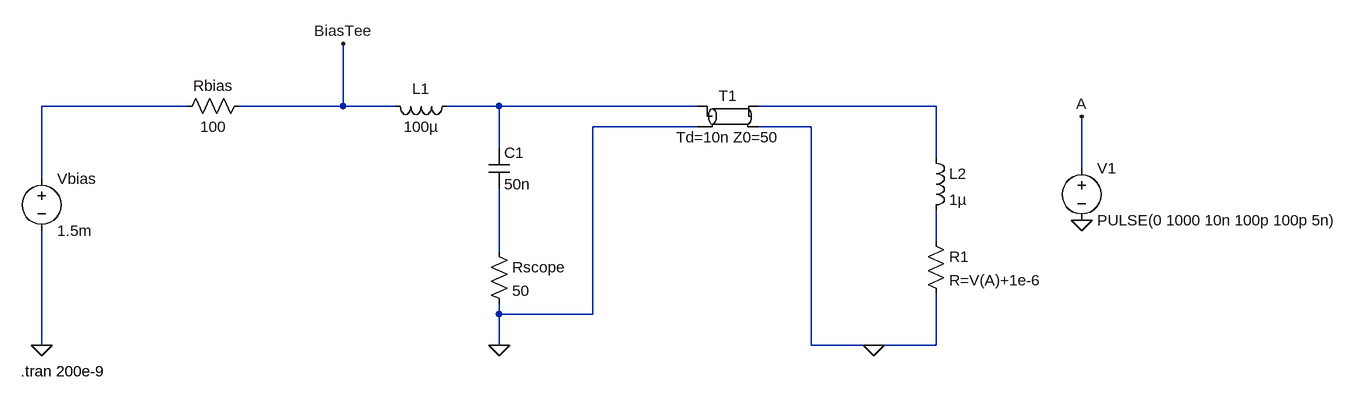
[diagram p0: schematic SNSPDmodel-I.asc]
SNSPDmodel-I.asc, the LTspice schematic file:
Version 4
SHEET 1 2084 680
WIRE 288 32 64 32
WIRE 528 32 528 -64
WIRE 528 32 368 32
WIRE 608 32 528 32
WIRE 768 32 688 32
WIRE 1072 32 768 32
WIRE 1440 32 1168 32
WIRE 1072 64 912 64
WIRE 1248 64 1168 64
WIRE 768 96 768 32
WIRE 1440 112 1440 32
WIRE 1664 128 1664 48
WIRE 64 144 64 32
WIRE 1440 240 1440 192
WIRE 768 256 768 160
WIRE 768 352 768 336
WIRE 912 352 912 64
WIRE 912 352 768 352
WIRE 64 400 64 224
WIRE 768 400 768 352
WIRE 1248 400 1248 64
WIRE 1344 400 1248 400
WIRE 1440 400 1440 320
WIRE 1440 400 1344 400
FLAG 64 400 0
FLAG 528 -64 BiasTee
FLAG 768 400 0
FLAG 1664 208 0
FLAG 1664 48 A
FLAG 1344 400 0
SYMBOL voltage 64 128 R0
WINDOW 123 0 0 Left 0
WINDOW 39 0 0 Left 0
SYMATTR InstName Vbias
SYMATTR Value 1.5m
SYMBOL res 384 16 R90
WINDOW 0 0 56 VBottom 2
WINDOW 3 32 56 VTop 2
SYMATTR InstName Rbias
SYMATTR Value 100
SYMBOL ind 704 16 R90
WINDOW 0 5 56 VBottom 2
WINDOW 3 32 56 VTop 2
SYMATTR InstName L1
SYMATTR Value 100µ
SYMBOL cap 752 96 R0
SYMATTR InstName C1
SYMATTR Value 50n
SYMBOL res 752 240 R0
SYMATTR InstName Rscope
SYMATTR Value 50
SYMBOL tline 1120 48 R0
SYMATTR InstName T1
SYMATTR Value Td=10n Z0=50
SYMBOL ind 1424 96 R0
SYMATTR InstName L2
SYMATTR Value 1µ
SYMBOL res 1424 224 R0
SYMATTR InstName R1
SYMATTR Value R=V(A)+1e-6
SYMBOL voltage 1664 112 R0
WINDOW 123 0 0 Left 0
WINDOW 39 0 0 Left 0
SYMATTR InstName V1
SYMATTR Value PULSE(0 1000 10n 100p 100p 5n)
TEXT 32 440 Left 2 !.tran 200e-9

The netlist it stands for:
* SNSPDmodel-I.asc
Vbias N001 0 1.5m
Rbias BiasTee N001 100
L1 N002 BiasTee 100µ
C1 N002 N005 50n
Rscope N005 0 50
T1 N002 0 N003 0 Td=10n Z0=50
L2 N003 N004 1µ
R1 N004 0 R=V(A)+1e-6
V1 A 0 PULSE(0 1000 10n 100p 100p 5n)
.tran 200e-9
.backanno
.end